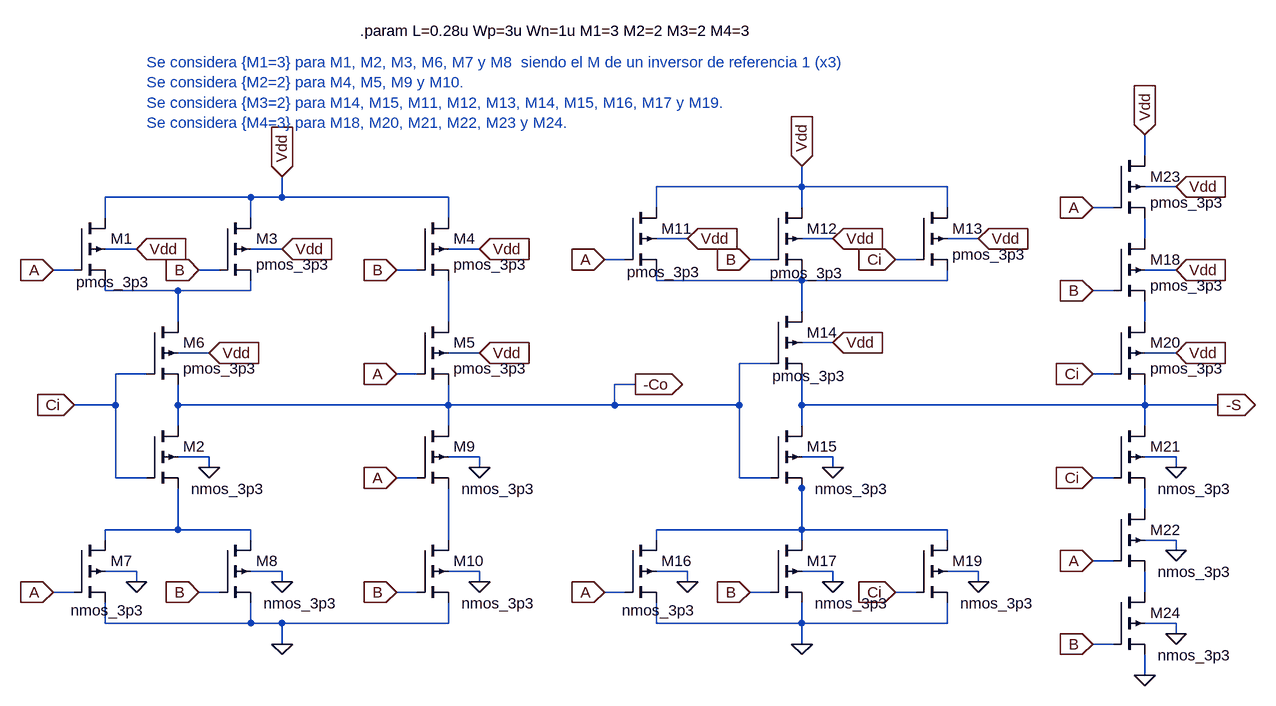
[diagram p0: schematic FAX1.asc]
FAX1.asc, the LTspice schematic file:
Version 4
SHEET 1 1704 1284
WIRE 1440 -784 1440 -816
WIRE 912 -736 912 -768
WIRE 912 -736 688 -736
WIRE 1136 -736 912 -736
WIRE 1488 -736 1440 -736
WIRE 64 -720 -160 -720
WIRE 112 -720 112 -752
WIRE 112 -720 64 -720
WIRE 368 -720 112 -720
WIRE 688 -704 688 -736
WIRE 912 -704 912 -736
WIRE 1136 -704 1136 -736
WIRE 1392 -704 1360 -704
WIRE -160 -688 -160 -720
WIRE 64 -688 64 -720
WIRE 368 -688 368 -720
WIRE 736 -656 688 -656
WIRE 960 -656 912 -656
WIRE 1184 -656 1136 -656
WIRE 1440 -656 1440 -688
WIRE -112 -640 -160 -640
WIRE 112 -640 64 -640
WIRE 416 -640 368 -640
WIRE 640 -624 608 -624
WIRE 864 -624 832 -624
WIRE 1088 -624 1056 -624
WIRE -208 -608 -240 -608
WIRE 16 -608 -16 -608
WIRE 320 -608 288 -608
WIRE 1488 -608 1440 -608
WIRE 688 -592 688 -608
WIRE 912 -592 912 -608
WIRE 912 -592 688 -592
WIRE 1136 -592 1136 -608
WIRE 1136 -592 912 -592
WIRE -160 -576 -160 -592
WIRE -48 -576 -160 -576
WIRE 64 -576 64 -592
WIRE 64 -576 -48 -576
WIRE 1392 -576 1360 -576
WIRE 912 -544 912 -592
WIRE -48 -528 -48 -576
WIRE 368 -528 368 -592
WIRE 1440 -528 1440 -560
WIRE 960 -496 912 -496
WIRE 0 -480 -48 -480
WIRE 416 -480 368 -480
WIRE 1488 -480 1440 -480
WIRE 864 -464 816 -464
WIRE -96 -448 -144 -448
WIRE 320 -448 288 -448
WIRE 1392 -448 1360 -448
WIRE 656 -432 624 -432
WIRE -144 -400 -144 -448
WIRE -144 -400 -208 -400
WIRE -48 -400 -48 -432
WIRE 368 -400 368 -432
WIRE 368 -400 -48 -400
WIRE 624 -400 624 -432
WIRE 624 -400 368 -400
WIRE 816 -400 816 -464
WIRE 816 -400 624 -400
WIRE 912 -400 912 -448
WIRE 1440 -400 1440 -432
WIRE 1440 -400 912 -400
WIRE 1552 -400 1440 -400
WIRE -48 -368 -48 -400
WIRE 368 -368 368 -400
WIRE 912 -368 912 -400
WIRE 1440 -368 1440 -400
WIRE 0 -320 -48 -320
WIRE 416 -320 368 -320
WIRE 960 -320 912 -320
WIRE 1488 -320 1440 -320
WIRE 0 -304 0 -320
WIRE 416 -304 416 -320
WIRE 960 -304 960 -320
WIRE 1488 -304 1488 -320
WIRE -144 -288 -144 -400
WIRE -96 -288 -144 -288
WIRE 320 -288 288 -288
WIRE 816 -288 816 -400
WIRE 864 -288 816 -288
WIRE 1392 -288 1360 -288
WIRE 912 -272 912 -288
WIRE 1440 -240 1440 -272
WIRE -48 -208 -48 -272
WIRE -48 -208 -160 -208
WIRE 64 -208 -48 -208
WIRE 912 -208 912 -272
WIRE 912 -208 688 -208
WIRE 1136 -208 912 -208
WIRE -160 -192 -160 -208
WIRE 64 -192 64 -208
WIRE 368 -192 368 -272
WIRE 688 -192 688 -208
WIRE 912 -192 912 -208
WIRE 1136 -192 1136 -208
WIRE 1488 -192 1440 -192
WIRE 1488 -176 1488 -192
WIRE 1392 -160 1360 -160
WIRE -112 -144 -160 -144
WIRE 112 -144 64 -144
WIRE 416 -144 368 -144
WIRE 736 -144 688 -144
WIRE 960 -144 912 -144
WIRE 1184 -144 1136 -144
WIRE -112 -128 -112 -144
WIRE 112 -128 112 -144
WIRE 416 -128 416 -144
WIRE 736 -128 736 -144
WIRE 960 -128 960 -144
WIRE 1184 -128 1184 -144
WIRE -208 -112 -240 -112
WIRE 16 -112 -16 -112
WIRE 320 -112 288 -112
WIRE 640 -112 608 -112
WIRE 864 -112 832 -112
WIRE 1088 -112 1056 -112
WIRE 1440 -112 1440 -144
WIRE -160 -64 -160 -96
WIRE 64 -64 64 -96
WIRE 64 -64 -160 -64
WIRE 112 -64 64 -64
WIRE 368 -64 368 -96
WIRE 368 -64 112 -64
WIRE 688 -64 688 -96
WIRE 912 -64 912 -96
WIRE 912 -64 688 -64
WIRE 1136 -64 1136 -96
WIRE 1136 -64 912 -64
WIRE 1488 -64 1440 -64
WIRE 1488 -48 1488 -64
WIRE 112 -32 112 -64
WIRE 912 -32 912 -64
WIRE 1392 -32 1360 -32
WIRE 1440 16 1440 -16
FLAG -112 -640 Vdd
IOPIN -112 -640 In
FLAG 0 -304 0
FLAG 112 -640 Vdd
IOPIN 112 -640 In
FLAG 416 -640 Vdd
IOPIN 416 -640 In
FLAG 416 -480 Vdd
IOPIN 416 -480 In
FLAG 0 -480 Vdd
IOPIN 0 -480 In
FLAG -112 -128 0
FLAG 112 -128 0
FLAG 416 -304 0
FLAG 416 -128 0
FLAG 112 -32 0
FLAG -208 -400 Ci
IOPIN -208 -400 In
FLAG -240 -608 A
IOPIN -240 -608 In
FLAG -240 -112 A
IOPIN -240 -112 In
FLAG 288 -448 A
IOPIN 288 -448 In
FLAG 288 -288 A
IOPIN 288 -288 In
FLAG 288 -112 B
IOPIN 288 -112 In
FLAG -16 -112 B
IOPIN -16 -112 In
FLAG -16 -608 B
IOPIN -16 -608 In
FLAG 288 -608 B
IOPIN 288 -608 In
FLAG 112 -752 Vdd
IOPIN 112 -752 In
FLAG 736 -656 Vdd
IOPIN 736 -656 In
FLAG 960 -656 Vdd
IOPIN 960 -656 In
FLAG 1184 -656 Vdd
IOPIN 1184 -656 In
FLAG 608 -624 A
IOPIN 608 -624 In
FLAG 832 -624 B
IOPIN 832 -624 In
FLAG 1056 -624 Ci
IOPIN 1056 -624 In
FLAG 912 -768 Vdd
IOPIN 912 -768 In
FLAG 960 -496 Vdd
IOPIN 960 -496 In
FLAG 960 -304 0
FLAG 736 -128 0
FLAG 960 -128 0
FLAG 1184 -128 0
FLAG 912 -32 0
FLAG 608 -112 A
IOPIN 608 -112 In
FLAG 1056 -112 Ci
IOPIN 1056 -112 In
FLAG 832 -112 B
IOPIN 832 -112 In
FLAG 1488 -608 Vdd
IOPIN 1488 -608 In
FLAG 1488 -480 Vdd
IOPIN 1488 -480 In
FLAG 1488 -304 0
FLAG 1488 -176 0
FLAG 1360 -448 Ci
IOPIN 1360 -448 In
FLAG 1360 -288 Ci
IOPIN 1360 -288 In
FLAG 1360 -160 A
IOPIN 1360 -160 In
FLAG 1360 -576 B
IOPIN 1360 -576 In
FLAG 1488 -736 Vdd
IOPIN 1488 -736 In
FLAG 1360 -704 A
IOPIN 1360 -704 In
FLAG 1488 -48 0
FLAG 1360 -32 B
IOPIN 1360 -32 In
FLAG 1440 16 0
FLAG 1440 -816 Vdd
IOPIN 1440 -816 In
FLAG 1552 -400 -S
IOPIN 1552 -400 Out
FLAG 656 -432 -Co
IOPIN 656 -432 Out
SYMBOL pmos4 -208 -688 R0
WINDOW 3 3 99 Left 2
SYMATTR Value pmos_3p3
SYMATTR InstName M1
SYMATTR Value2 l={L} w={Wp} m={M1}
SYMBOL pmos4 -96 -368 R0
WINDOW 3 68 97 Left 2
SYMATTR Value nmos_3p3
SYMATTR InstName M2
SYMATTR Value2 l={L} w={Wn} m={M1}
SYMBOL pmos4 16 -688 R0
SYMATTR InstName M3
SYMATTR Value pmos_3p3
SYMATTR Value2 l={L} w={Wp} m={M1}
SYMBOL pmos4 320 -688 R0
SYMATTR InstName M4
SYMATTR Value pmos_3p3
SYMATTR Value2 l={L} w={Wp} m={M2}
SYMBOL pmos4 320 -528 R0
SYMATTR InstName M5
SYMATTR Value pmos_3p3
SYMATTR Value2 l={L} w={Wp} m={M2}
SYMBOL pmos4 -96 -528 R0
SYMATTR InstName M6
SYMATTR Value pmos_3p3
SYMATTR Value2 l={L} w={Wp} m={M1}
SYMBOL pmos4 -208 -192 R0
WINDOW 3 -5 108 Left 2
SYMATTR Value nmos_3p3
SYMATTR InstName M7
SYMATTR Value2 l={L} w={Wn} m={M1}
SYMBOL pmos4 16 -192 R0
WINDOW 3 68 97 Left 2
SYMATTR Value nmos_3p3
SYMATTR InstName M8
SYMATTR Value2 l={L} w={Wn} m={M1}
SYMBOL pmos4 320 -368 R0
WINDOW 3 68 97 Left 2
SYMATTR Value nmos_3p3
SYMATTR InstName M9
SYMATTR Value2 l={L} w={Wn} m={M2}
SYMBOL pmos4 320 -192 R0
WINDOW 3 68 97 Left 2
SYMATTR Value nmos_3p3
SYMATTR InstName M10
SYMATTR Value2 l={L} w={Wn} m={M2}
SYMBOL pmos4 640 -704 R0
WINDOW 3 3 99 Left 2
SYMATTR Value pmos_3p3
SYMATTR InstName M11
SYMATTR Value2 l={L} w={Wp} m={M3}
SYMBOL pmos4 864 -704 R0
WINDOW 3 -1 101 Left 2
SYMATTR Value pmos_3p3
SYMATTR InstName M12
SYMATTR Value2 l={L} w={Wp} m={M3}
SYMBOL pmos4 1088 -704 R0
SYMATTR InstName M13
SYMATTR Value pmos_3p3
SYMATTR Value2 l={L} w={Wp} m={M3}
SYMBOL pmos4 864 -544 R0
WINDOW 3 3 99 Left 2
SYMATTR Value pmos_3p3
SYMATTR InstName M14
SYMATTR Value2 l={L} w={Wp} m={M3}
SYMBOL pmos4 864 -368 R0
WINDOW 3 68 97 Left 2
SYMATTR Value nmos_3p3
SYMATTR InstName M15
SYMATTR Value2 l={L} w={Wn} m={M3}
SYMBOL pmos4 640 -192 R0
WINDOW 3 -5 108 Left 2
SYMATTR Value nmos_3p3
SYMATTR InstName M16
SYMATTR Value2 l={L} w={Wn} m={M3}
SYMBOL pmos4 864 -192 R0
WINDOW 3 68 97 Left 2
SYMATTR Value nmos_3p3
SYMATTR InstName M17
SYMATTR Value2 l={L} w={Wn} m={M3}
SYMBOL pmos4 1088 -192 R0
WINDOW 3 68 97 Left 2
SYMATTR Value nmos_3p3
SYMATTR InstName M19
SYMATTR Value2 l={L} w={Wn} m={M3}
SYMBOL pmos4 1392 -656 R0
SYMATTR InstName M18
SYMATTR Value pmos_3p3
SYMATTR Value2 l={L} w={Wp}
SYMBOL pmos4 1392 -528 R0
SYMATTR InstName M20
SYMATTR Value pmos_3p3
SYMATTR Value2 l={L} w={Wp}
SYMBOL pmos4 1392 -368 R0
WINDOW 3 68 97 Left 2
SYMATTR Value nmos_3p3
SYMATTR InstName M21
SYMATTR Value2 l={L} w={Wn}
SYMBOL pmos4 1392 -240 R0
WINDOW 3 68 97 Left 2
SYMATTR Value nmos_3p3
SYMATTR InstName M22
SYMATTR Value2 l={L} w={Wn}
SYMBOL pmos4 1392 -784 R0
SYMATTR InstName M23
SYMATTR Value pmos_3p3
SYMATTR Value2 l={L} w={Wp}
SYMBOL pmos4 1392 -112 R0
WINDOW 3 68 97 Left 2
SYMATTR Value nmos_3p3
SYMATTR InstName M24
SYMATTR Value2 l={L} w={Wn}
TEXT 232 -976 Left 2 !.param L=0.28u Wp=3u Wn=1u M1=3 M2=2 M3=2 M4=3
TEXT -96 -928 Left 2 ;Se considera {M1=3} para M1, M2, M3, M6, M7 y M8  siendo el M de un inversor de referencia 1 (x3)\nSe considera {M2=2} para M4, M5, M9 y M10.\nSe considera {M3=2} para M14, M15, M11, M12, M13, M14, M15, M16, M17 y M19.\nSe considera {M4=3} para M18, M20, M21, M22, M23 y M24.

The netlist it stands for:
* FAX1.asc
M1 Vdd A N003 Vdd pmos_3p3 l={L} w={Wp} m={M1}
M2 -Co Ci N008 0 nmos_3p3 l={L} w={Wn} m={M1}
M3 Vdd B N003 Vdd pmos_3p3 l={L} w={Wp} m={M1}
M4 Vdd B N004 Vdd pmos_3p3 l={L} w={Wp} m={M2}
M5 N004 A -Co Vdd pmos_3p3 l={L} w={Wp} m={M2}
M6 N003 Ci -Co Vdd pmos_3p3 l={L} w={Wp} m={M1}
M7 N008 A 0 0 nmos_3p3 l={L} w={Wn} m={M1}
M8 N008 B 0 0 nmos_3p3 l={L} w={Wn} m={M1}
M9 -Co A N009 0 nmos_3p3 l={L} w={Wn} m={M2}
M10 N009 B 0 0 nmos_3p3 l={L} w={Wn} m={M2}
M11 Vdd A N002 Vdd pmos_3p3 l={L} w={Wp} m={M3}
M12 Vdd B N002 Vdd pmos_3p3 l={L} w={Wp} m={M3}
M13 Vdd Ci N002 Vdd pmos_3p3 l={L} w={Wp} m={M3}
M14 N002 -Co -S Vdd pmos_3p3 l={L} w={Wp} m={M3}
M15 -S -Co N006 0 nmos_3p3 l={L} w={Wn} m={M3}
M16 N006 A 0 0 nmos_3p3 l={L} w={Wn} m={M3}
M17 N006 B 0 0 nmos_3p3 l={L} w={Wn} m={M3}
M19 N006 Ci 0 0 nmos_3p3 l={L} w={Wn} m={M3}
M18 N001 B N005 Vdd pmos_3p3 l={L} w={Wp}
M20 N005 Ci -S Vdd pmos_3p3 l={L} w={Wp}
M21 -S Ci N007 0 nmos_3p3 l={L} w={Wn}
M22 N007 A N010 0 nmos_3p3 l={L} w={Wn}
M23 Vdd A N001 Vdd pmos_3p3 l={L} w={Wp}
M24 N010 B 0 0 nmos_3p3 l={L} w={Wn}
.model NMOS NMOS
.model PMOS PMOS
.lib standard.mos
.param L=0.28u Wp=3u Wn=1u M1=3 M2=2 M3=2 M4=3
* Se considera {M1=3} para M1, M2, M3, M6, M7 y M8  siendo el M de un inversor de referencia 1 (x3)
* Se considera {M2=2} para M4, M5, M9 y M10.
* Se considera {M3=2} para M14, M15, M11, M12, M13, M14, M15, M16, M17 y M19.
* Se considera {M4=3} para M18, M20, M21, M22, M23 y M24.
.backanno
.end